# Altium schematic sheet panel4.SchDoc
size A
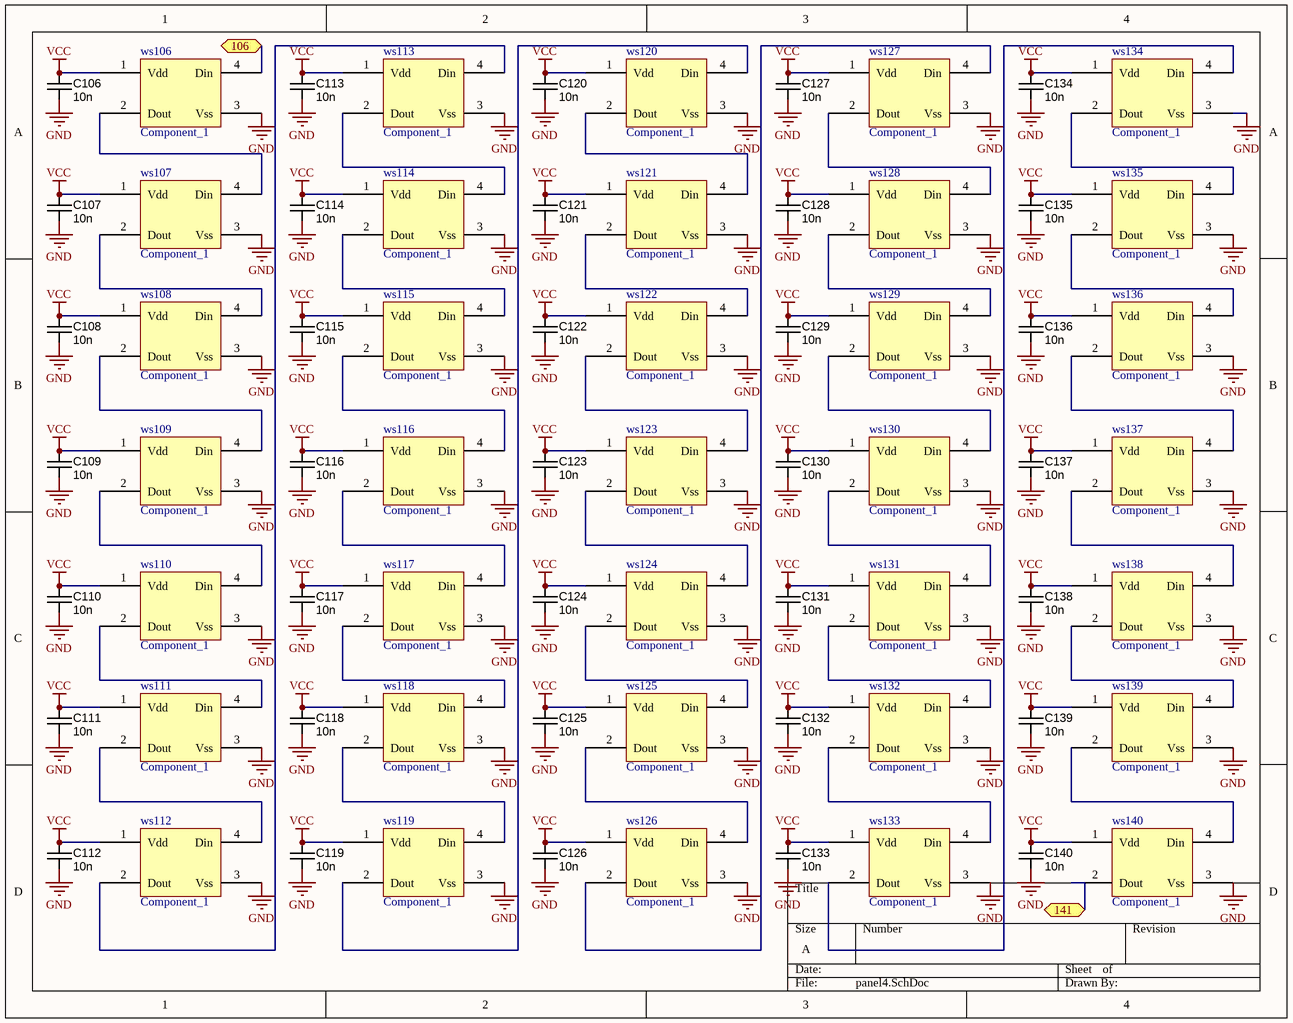
[diagram p0: panel4.SchDoc]

## Parts
C106  value 10n  [CAPC1608X90N]  (hidden comment: approved sub OK)
C107  value 10n  [CAPC1608X90N]  (hidden comment: approved sub OK)
C108  value 10n  [CAPC1608X90N]  (hidden comment: approved sub OK)
C109  value 10n  [CAPC1608X90N]  (hidden comment: approved sub OK)
C110  value 10n  [CAPC1608X90N]  (hidden comment: approved sub OK)
C111  value 10n  [CAPC1608X90N]  (hidden comment: approved sub OK)
C112  value 10n  [CAPC1608X90N]  (hidden comment: approved sub OK)
C113  value 10n  [CAPC1608X90N]  (hidden comment: approved sub OK)
C114  value 10n  [CAPC1608X90N]  (hidden comment: approved sub OK)
C115  value 10n  [CAPC1608X90N]  (hidden comment: approved sub OK)
C116  value 10n  [CAPC1608X90N]  (hidden comment: approved sub OK)
C117  value 10n  [CAPC1608X90N]  (hidden comment: approved sub OK)
C118  value 10n  [CAPC1608X90N]  (hidden comment: approved sub OK)
C119  value 10n  [CAPC1608X90N]  (hidden comment: approved sub OK)
C120  value 10n  [CAPC1608X90N]  (hidden comment: approved sub OK)
C121  value 10n  [CAPC1608X90N]  (hidden comment: approved sub OK)
C122  value 10n  [CAPC1608X90N]  (hidden comment: approved sub OK)
C123  value 10n  [CAPC1608X90N]  (hidden comment: approved sub OK)
C124  value 10n  [CAPC1608X90N]  (hidden comment: approved sub OK)
C125  value 10n  [CAPC1608X90N]  (hidden comment: approved sub OK)
C126  value 10n  [CAPC1608X90N]  (hidden comment: approved sub OK)
C127  value 10n  [CAPC1608X90N]  (hidden comment: approved sub OK)
C128  value 10n  [CAPC1608X90N]  (hidden comment: approved sub OK)
C129  value 10n  [CAPC1608X90N]  (hidden comment: approved sub OK)
C130  value 10n  [CAPC1608X90N]  (hidden comment: approved sub OK)
C131  value 10n  [CAPC1608X90N]  (hidden comment: approved sub OK)
C132  value 10n  [CAPC1608X90N]  (hidden comment: approved sub OK)
C133  value 10n  [CAPC1608X90N]  (hidden comment: approved sub OK)
C134  value 10n  [CAPC1608X90N]  (hidden comment: approved sub OK)
C135  value 10n  [CAPC1608X90N]  (hidden comment: approved sub OK)
C136  value 10n  [CAPC1608X90N]  (hidden comment: approved sub OK)
C137  value 10n  [CAPC1608X90N]  (hidden comment: approved sub OK)
C138  value 10n  [CAPC1608X90N]  (hidden comment: approved sub OK)
C139  value 10n  [CAPC1608X90N]  (hidden comment: approved sub OK)
C140  value 10n  [CAPC1608X90N]  (hidden comment: approved sub OK)
ws106  Component_1  [SOP4]
ws107  Component_1  [SOP4]
ws108  Component_1  [SOP4]
ws109  Component_1  [SOP4]
ws110  Component_1  [SOP4]
ws111  Component_1  [SOP4]
ws112  Component_1  [SOP4]
ws113  Component_1  [SOP4]
ws114  Component_1  [SOP4]
ws115  Component_1  [SOP4]
ws116  Component_1  [SOP4]
ws117  Component_1  [SOP4]
ws118  Component_1  [SOP4]
ws119  Component_1  [SOP4]
ws120  Component_1  [SOP4]
ws121  Component_1  [SOP4]
ws122  Component_1  [SOP4]
ws123  Component_1  [SOP4]
ws124  Component_1  [SOP4]
ws125  Component_1  [SOP4]
ws126  Component_1  [SOP4]
ws127  Component_1  [SOP4]
ws128  Component_1  [SOP4]
ws129  Component_1  [SOP4]
ws130  Component_1  [SOP4]
ws131  Component_1  [SOP4]
ws132  Component_1  [SOP4]
ws133  Component_1  [SOP4]
ws134  Component_1  [SOP4]
ws135  Component_1  [SOP4]
ws136  Component_1  [SOP4]
ws137  Component_1  [SOP4]
ws138  Component_1  [SOP4]
ws139  Component_1  [SOP4]
ws140  Component_1  [SOP4]

## Ports
106, 141

## Nets
GND: C106.2 C107.2 C108.2 C109.2 C110.2 C111.2 C112.2 C113.2 C114.2 C115.2 C116.2 C117.2 C118.2 C119.2 C120.2 C121.2 C122.2 C123.2 C124.2 C125.2 C126.2 C127.2 C128.2 C129.2 C130.2 C131.2 C132.2 C133.2 C134.2 C135.2 C136.2 C137.2 C138.2 C139.2 C140.2 ws106.3(Vss) ws107.3(Vss) ws108.3(Vss) ws109.3(Vss) ws110.3(Vss) ws111.3(Vss) ws112.3(Vss) ws113.3(Vss) ws114.3(Vss) ws115.3(Vss) ws116.3(Vss) ws117.3(Vss) ws118.3(Vss) ws119.3(Vss) ws120.3(Vss) ws121.3(Vss) ws122.3(Vss) ws123.3(Vss) ws124.3(Vss) ws125.3(Vss) ws126.3(Vss) ws127.3(Vss) ws128.3(Vss) ws129.3(Vss) ws130.3(Vss) ws131.3(Vss) ws132.3(Vss) ws133.3(Vss) ws134.3(Vss) ws135.3(Vss) ws136.3(Vss) ws137.3(Vss) ws138.3(Vss) ws139.3(Vss) ws140.3(Vss)
VCC: C106.1 C107.1 C108.1 C109.1 C110.1 C111.1 C112.1 C113.1 C114.1 C115.1 C116.1 C117.1 C118.1 C119.1 C120.1 C121.1 C122.1 C123.1 C124.1 C125.1 C126.1 C127.1 C128.1 C129.1 C130.1 C131.1 C132.1 C133.1 C134.1 C135.1 C136.1 C137.1 C138.1 C139.1 C140.1 ws106.1(Vdd) ws107.1(Vdd) ws108.1(Vdd) ws109.1(Vdd) ws110.1(Vdd) ws111.1(Vdd) ws112.1(Vdd) ws113.1(Vdd) ws114.1(Vdd) ws115.1(Vdd) ws116.1(Vdd) ws117.1(Vdd) ws118.1(Vdd) ws119.1(Vdd) ws120.1(Vdd) ws121.1(Vdd) ws122.1(Vdd) ws123.1(Vdd) ws124.1(Vdd) ws125.1(Vdd) ws126.1(Vdd) ws127.1(Vdd) ws128.1(Vdd) ws129.1(Vdd) ws130.1(Vdd) ws131.1(Vdd) ws132.1(Vdd) ws133.1(Vdd) ws134.1(Vdd) ws135.1(Vdd) ws136.1(Vdd) ws137.1(Vdd) ws138.1(Vdd) ws139.1(Vdd) ws140.1(Vdd)
106: ws106.4(Din) ; port 106
141: ws140.2(Dout) ; port 141
Netws106_2: ws106.2(Dout) ws107.4(Din)
Netws107_2: ws107.2(Dout) ws108.4(Din)
Netws108_2: ws108.2(Dout) ws109.4(Din)
Netws109_2: ws109.2(Dout) ws110.4(Din)
Netws110_2: ws110.2(Dout) ws111.4(Din)
Netws111_2: ws111.2(Dout) ws112.4(Din)
Netws112_2: ws112.2(Dout) ws113.4(Din)
Netws113_2: ws113.2(Dout) ws114.4(Din)
Netws114_2: ws114.2(Dout) ws115.4(Din)
Netws115_2: ws115.2(Dout) ws116.4(Din)
Netws116_2: ws116.2(Dout) ws117.4(Din)
Netws117_2: ws117.2(Dout) ws118.4(Din)
Netws118_2: ws118.2(Dout) ws119.4(Din)
Netws119_2: ws119.2(Dout) ws120.4(Din)
Netws120_2: ws120.2(Dout) ws121.4(Din)
Netws121_2: ws121.2(Dout) ws122.4(Din)
Netws122_2: ws122.2(Dout) ws123.4(Din)
Netws123_2: ws123.2(Dout) ws124.4(Din)
Netws124_2: ws124.2(Dout) ws125.4(Din)
Netws125_2: ws125.2(Dout) ws126.4(Din)
Netws126_2: ws126.2(Dout) ws127.4(Din)
Netws127_2: ws127.2(Dout) ws128.4(Din)
Netws128_2: ws128.2(Dout) ws129.4(Din)
Netws129_2: ws129.2(Dout) ws130.4(Din)
Netws130_2: ws130.2(Dout) ws131.4(Din)
Netws131_2: ws131.2(Dout) ws132.4(Din)
Netws132_2: ws132.2(Dout) ws133.4(Din)
Netws133_2: ws133.2(Dout) ws134.4(Din)
Netws134_2: ws134.2(Dout) ws135.4(Din)
Netws135_2: ws135.2(Dout) ws136.4(Din)
Netws136_2: ws136.2(Dout) ws137.4(Din)
Netws137_2: ws137.2(Dout) ws138.4(Din)
Netws138_2: ws138.2(Dout) ws139.4(Din)
Netws139_2: ws139.2(Dout) ws140.4(Din)

## Library data of the parts
C106-C140 = CAPC_10n_0603_X7R_100V_10%: Capacitor SMD Cer 10nF 10% 100V X7R 0603; Manufacturer: Murata Electronics North America; Manufacturer Part Number: GCM188R72A103KA37D; Ratings: 100V; X7R; Material: ceramic; SCDType: undef; Package / Case: 0603 (1608 metric); Tolerance: ±10%; Supplier 1: Digi-Key; Supplier Part Number 1: 490-4781-1-ND